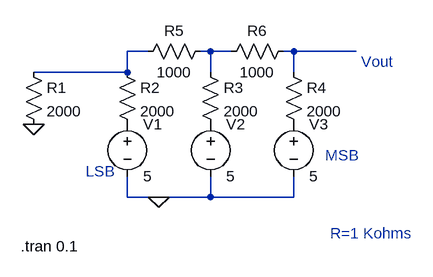
[diagram p0: schematic Draft5.asc]
Draft5.asc, the LTspice schematic file:
Version 4
SHEET 1 880 680
WIRE 144 48 112 48
WIRE 240 48 224 48
WIRE 272 48 240 48
WIRE 368 48 352 48
WIRE 464 48 368 48
WIRE 112 80 112 48
WIRE 112 80 -32 80
WIRE 240 80 240 48
WIRE 368 80 368 48
WIRE 112 272 112 240
WIRE 160 272 112 272
WIRE 240 272 240 240
WIRE 240 272 160 272
WIRE 368 272 368 240
WIRE 368 272 240 272
FLAG -32 160 0
FLAG 160 272 0
SYMBOL res -48 64 R0
SYMATTR InstName R1
SYMATTR Value 2000
SYMBOL res 96 64 R0
SYMATTR InstName R2
SYMATTR Value 2000
SYMBOL res 224 64 R0
SYMATTR InstName R3
SYMATTR Value 2000
SYMBOL res 352 64 R0
SYMATTR InstName R4
SYMATTR Value 2000
SYMBOL res 128 64 R270
WINDOW 0 32 56 VTop 2
WINDOW 3 0 56 VBottom 2
SYMATTR InstName R5
SYMATTR Value 1000
SYMBOL res 256 64 R270
WINDOW 0 32 56 VTop 2
WINDOW 3 0 56 VBottom 2
SYMATTR InstName R6
SYMATTR Value 1000
SYMBOL voltage 112 144 R0
SYMATTR InstName V1
SYMATTR Value 5
SYMBOL voltage 240 144 R0
SYMATTR InstName V2
SYMATTR Value 5
SYMBOL voltage 368 144 R0
WINDOW 123 0 0 Left 2
WINDOW 39 0 0 Left 2
SYMATTR InstName V3
SYMATTR Value 5
TEXT 48 232 Left 2 ;LSB
TEXT 416 208 Left 2 ;MSB
TEXT 424 328 Left 2 ;R=1 Kohms
TEXT 472 64 Left 2 ;Vout
TEXT -52 348 Left 2 !.tran 0.1

The netlist it stands for:
* Draft5.asc
R1 N001 0 2000
R2 N001 P001 2000
R3 N002 P002 2000
R4 N003 P003 2000
R5 N001 N002 1000
R6 N002 N003 1000
V1 P001 0 5
V2 P002 0 5
V3 P003 0 5
* LSB
* MSB
* R=1 Kohms
* Vout
.tran 0.1
.backanno
.end